# Altium schematic sheet i-o pines.SchDoc
size A4
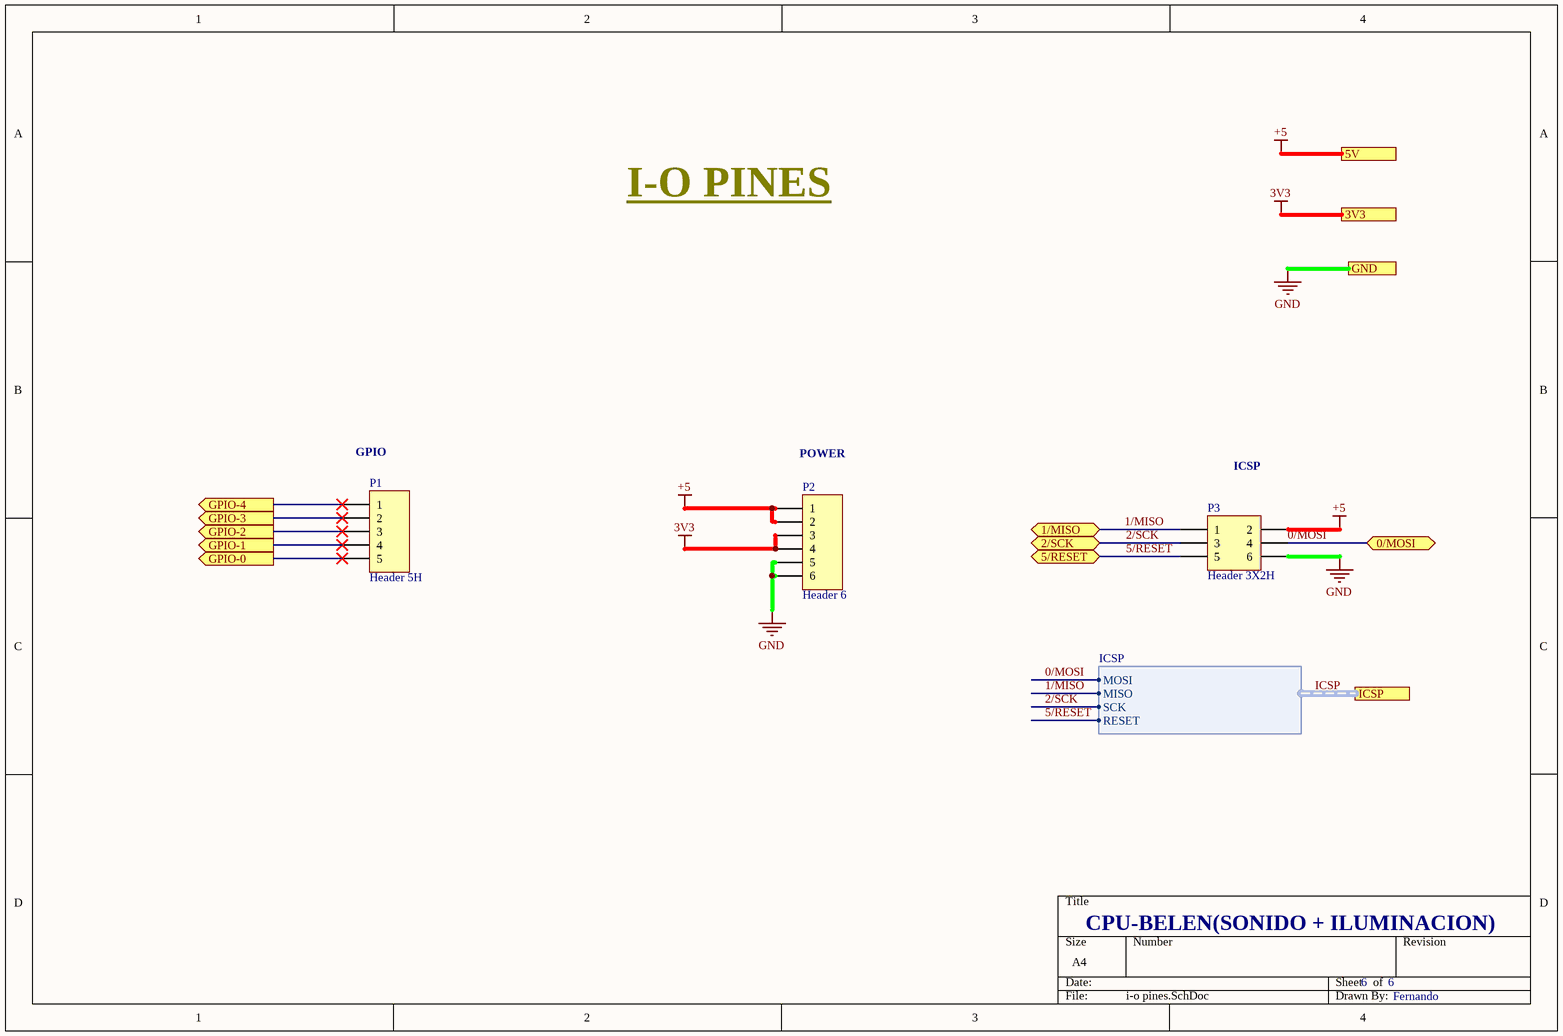
[diagram p0: i-o pines.SchDoc]

## Parts
P1  Header 5H  [HDR1X5]
P2  Header 6  [HDR1X6]
P3  Header 3X2H  [HDR2X3]

## Ports
0/MOSI (bidir), 1/MISO (bidir), 2/SCK (bidir), 3V3, 5/RESET (bidir), 5V, GND, GPIO-0 (out), GPIO-1 (out), GPIO-2 (out), GPIO-3 (out), GPIO-4 (out), ICSP (harness ICSP)

## Harnesses
ICSP: MOSI, MISO, SCK, RESET

## Nets
3V3: P2.3 P2.4 ; port 3V3
+5: P2.1 P2.2 P3.2 ; port 5V
GND: P2.5 P2.6 P3.6 ; port GND
0/MOSI: P3.4 ; port 0/MOSI, port ICSP.MOSI
1/MISO: P3.1 ; port 1/MISO, port ICSP.MISO
2/SCK: P3.3 ; port 2/SCK, port ICSP.SCK
5/RESET: P3.5 ; port 5/RESET, port ICSP.RESET
GPIO-0: P1.5 ; port GPIO-0
GPIO-1: P1.4 ; port GPIO-1
GPIO-2: P1.3 ; port GPIO-2
GPIO-3: P1.2 ; port GPIO-3
GPIO-4: P1.1 ; port GPIO-4

## Buses and harness runs
harness ICSP = port ICSP

## Notes on the sheet
- I-O PINES
- (near P1) GPIO
- (near P2) POWER
- ICSP
- CPU-BELEN(SONIDO + ILUMINACION)
- 6
- Fernando

## Library data of the parts
P1 = Header 5H: Header, 5-Pin, Right Angle; LatestRevisionDate: 17-Jul-2002; LatestRevisionNote: Re-released for DXP Platform.; Publisher: Altium Limited
P2 = Header 6: Header, 6-Pin; LatestRevisionDate: 17-Jul-2002; LatestRevisionNote: Re-released for DXP Platform.; Publisher: Altium Limited
P3 = Header 3X2H: Header, 3-Pin, Dual row, Right Angle; LatestRevisionDate: 17-Jul-2002; LatestRevisionNote: Re-released for DXP Platform.; Publisher: Altium Limited